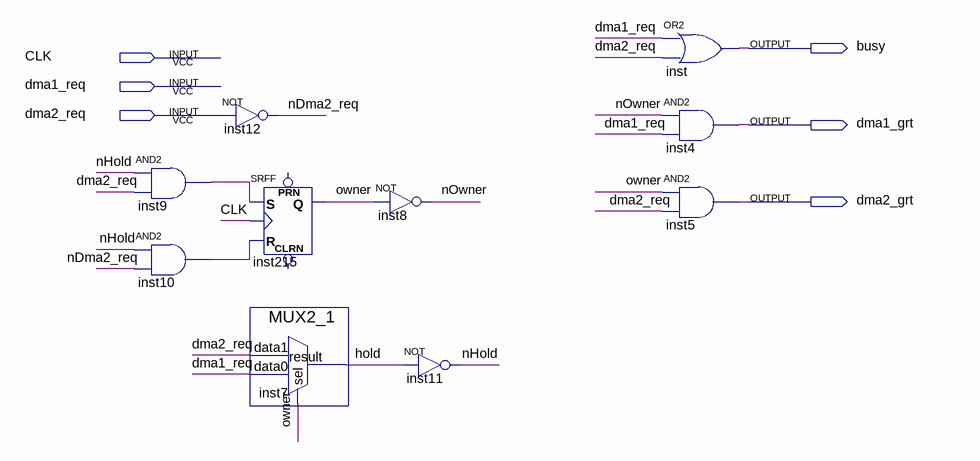
[diagram p0: schematic sheet]
// Quartus schematic arbitar.bdf as structural Verilog: 10 symbols, 6 pins
module arbitar (
  input  CLK,
  input  dma1_req,
  input  dma2_req,
  output busy,
  output dma1_grt,
  output dma2_grt
);

  wire hold, inst9_out, inst10_out, nDma2_req, nHold, nOwner, owner;

  and inst9 (inst9_out, nHold, dma2_req);
  and inst10 (inst10_out, nHold, nDma2_req);
  not inst12 (nDma2_req, dma2_req);
  SRFF inst215 (.S(inst9_out), .R(inst10_out), .CLK(CLK), .Q(owner));  // open: PRN, CLRN
  MUX2_1 inst7 (.data1(dma2_req), .data0(dma1_req), .sel(owner), .result(hold));
  not inst8 (nOwner, owner);
  not inst11 (nHold, hold);
  or inst (busy, dma1_req, dma2_req);
  and inst4 (dma1_grt, nOwner, dma1_req);
  and inst5 (dma2_grt, owner, dma2_req);
endmodule
